# EAGLE design CAN Tester rev1 (EAGLE 9.2.1)
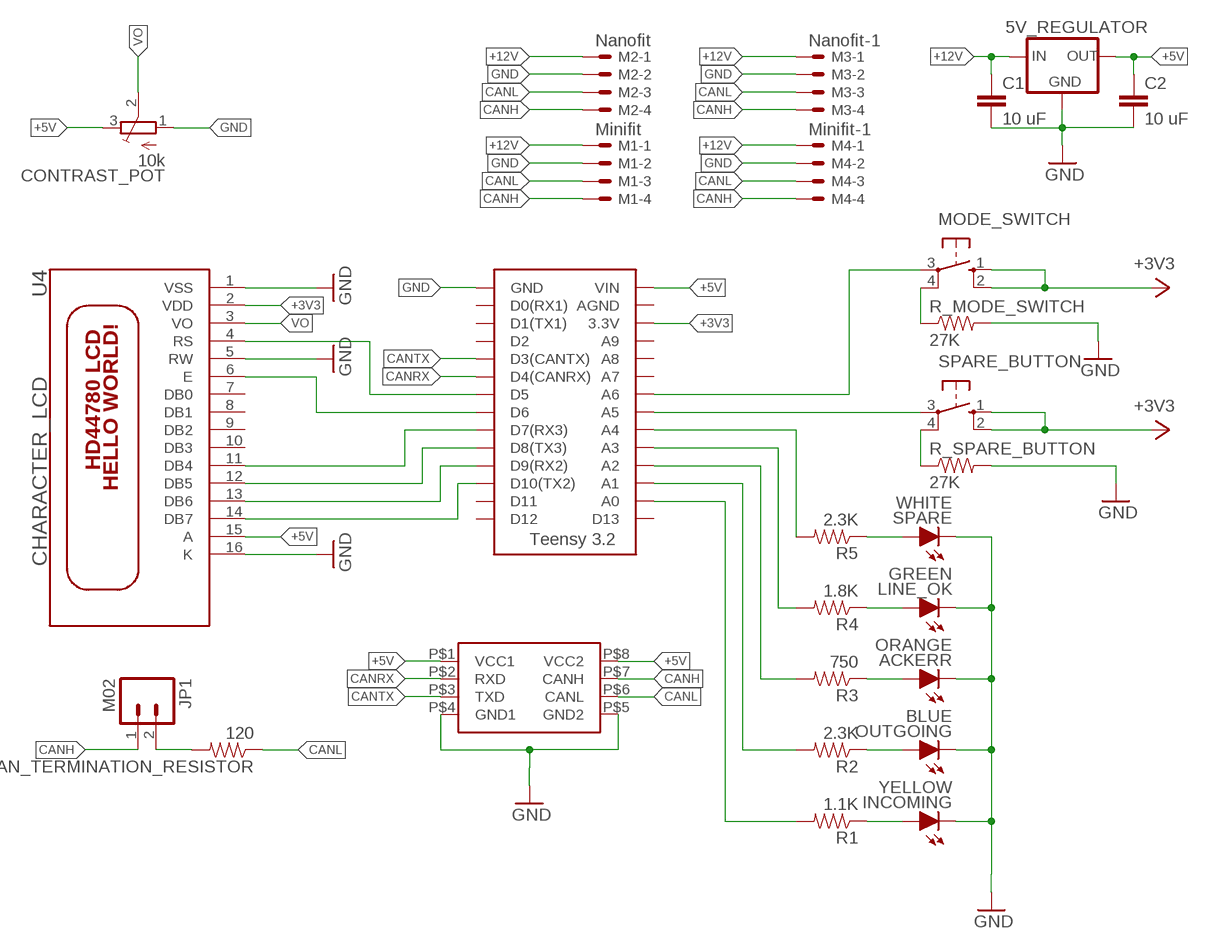
[diagram p0: schematic, sheet 1]

## Parts
5V_REGULATOR  5VREG_LM340-NLM340MPX-5.0/NOPB  [SOT223]
ACKERR  ORANGE  LED-0805  [LED-805]
C1  10 uF  CAP0805  [0805]
C2  10 uF  CAP0805  [0805]
CAN_TERMINATION_RESISTOR  120  RESISTOR0805-RES  [0805]
CONTRAST_POT  10k  TRIMPOT3386  [TRIM-3386]
INCOMING  YELLOW  LED-0805  [LED-805]
JP1  M02  [1X02]
LINE_OK  GREEN  LED-0805  [LED-805]
M1  Minifit  CONNECTOR-4  [MINIFIT_5566-4]
M2  Nanofit  CONNECTOR-4NANO-FIT-VERTICAL-4  [NANO-FIT_VERTICAL-4]
M3  Nanofit-1  CONNECTOR-4NANO-FIT-VERTICAL-4  [NANO-FIT_VERTICAL-4]
M4  Minifit-1  CONNECTOR-4  [MINIFIT_5566-4]
MODE_SWITCH  BTN_10-XX  [B3F-10XX]
OUTGOING  BLUE  LED-0805  [LED-805]
R1  1.1K  RESISTOR0805-RES  [0805]
R2  2.3K  RESISTOR0805-RES  [0805]
R3  750  RESISTOR0805-RES  [0805]
R4  1.8K  RESISTOR0805-RES  [0805]
R5  2.3K  RESISTOR0805-RES  [0805]
R_MODE_SWITCH  27K  RESISTOR0805-RES  [0805]
R_SPARE_BUTTON  27K  RESISTOR0805-RES  [0805]
SPARE  WHITE  LED-0805  [LED-805]
SPARE_BUTTON  BTN_10-XX  [B3F-10XX]
U1  ISOLATED CAN TRANSCIEVER  ISO1050CAN  [DUB8]
U3  TEENSY_3.2_SIMPLE  [TEENSY_3.2_SIMPLE]
U4  CHARACTER_LCD  HD44780LCD-1602  [LCD1602]

## Nets
+3V3: MODE_SWITCH.1(S) MODE_SWITCH.2(S1) SPARE_BUTTON.1(S) SPARE_BUTTON.2(S1) U3.3.3V U4.2(VDD)
+5V: 5V_REGULATOR.3(OUT) C2.1 CONTRAST_POT.3(E) U1.P$1(VCC1) U1.P$8(VCC2) U3.VIN U4.15(A)
+12V: 5V_REGULATOR.1(IN) C1.1 M1.1 M2.P$1 M3.P$1 M4.1
CANH: JP1.1 M1.4 M2.P$4 M3.P$4 M4.4 U1.P$7(CANH)
CANL: CAN_TERMINATION_RESISTOR.1 CAN_TERMINATION_RESISTOR.2 JP1.2 M1.3 M2.P$3 M3.P$3 M4.3 U1.P$6(CANL)
CANRX: U1.P$2(RXD) U3.D4(CANRX)
CANTX: U1.P$3(TXD) U3.D3(CANTX)
GND: 5V_REGULATOR.2(GND) 5V_REGULATOR.4(GND) ACKERR.C C1.2 C2.2 CONTRAST_POT.1(A) INCOMING.C LINE_OK.C M1.2 M2.P$2 M3.P$2 M4.2 OUTGOING.C R_MODE_SWITCH.2 R_SPARE_BUTTON.2 SPARE.C U3.GND U4.1(VSS) U4.5(RW) U4.16(K)
N$1: R1.2 U3.A0
N$2: R5.1 SPARE.A
N$3: SPARE_BUTTON.3(P) U3.A5
N$4: R2.2 U3.A1
N$5: R3.2 U3.A2
N$6: R4.2 U3.A3
N$7: R5.2 U3.A4
N$8: LINE_OK.A R4.1
N$9: ACKERR.A R3.1
N$10: OUTGOING.A R2.1
N$11: INCOMING.A R1.1
N$12: MODE_SWITCH.4(P1) R_MODE_SWITCH.1
N$13: MODE_SWITCH.3(P) U3.A6
N$14: R_SPARE_BUTTON.1 SPARE_BUTTON.4(P1)
N$16: U1.P$4(GND1) U1.P$5(GND2)
N$17: U3.D5 U4.4(RS)
N$18: U3.D6 U4.6(E)
N$19: U3.D7(RX3) U4.11(DB4)
N$20: U3.D8(TX3) U4.12(DB5)
N$21: U3.D9(RX2) U4.13(DB6)
N$22: U3.D10(TX2) U4.14(DB7)
VO: CONTRAST_POT.2(S) U4.3(VO)
Unconnected: U3.A7 U3.A8 U3.A9 U3.AGND U3.D0(RX1) U3.D1(TX1) U3.D2 U3.D11 U3.D12 U3.D13 U4.7(DB0) U4.8(DB1) U4.9(DB2) U4.10(DB3)

## Library data of the parts
5V_REGULATOR = HyTechDevices:5VREG_LM340-N: Voltage Regulator 5v linear voltage regulator Datasheet <http://www.mouser.com/ProductDetail/Texas-Instruments/LM340MPX-50-NOPB/?qs=X1J7HmVL2ZGZwtTFRQ9ItA%3D%3D> MAX current out: 1.5A MAX voltage in: 35V
ACKERR INCOMING LINE_OK OUTGOING SPARE = HyTechDevices:LED: Light Emitting Diode (LED) Source: Dangerous Prototypes Eagle Library <https://github.com/DangerousPrototypes/Eagle_Part_Library>
C1 C2 = HyTechDevices:CAP: Capacitor Standard 0603 ceramic capacitor, and 0.1" leaded capacitor.
CAN_TERMINATION_RESISTOR R1-R5 R_MODE_SWITCH R_SPARE_BUTTON = HyTechDevices:RESISTOR: Resistor Basic schematic elements and footprints for 0603, 1206, and PTH resistors.
CONTRAST_POT = HyTechDevices:TRIMPOT: SMT trimmer potentiometer part number TC33X http://www.ladyada.net/library/eagle
JP1 = HyTechDevices:M02: Standard 2-pin 0.1" header. NOTES ON THE VARIANTS LOCK and LOCK_LONGPADS... This footprint was designed to help hold the alignment of a through-hole component (i.e. 6-pin header) while soldering it into place. You may notice that each hole has been shifted either up or down by 0.005 of an inch from it's more standard position (which is a perfectly straight line). This slight alteration caused the pins (the squares in the middle) to touch the edges of the holes. Because they are alternating, it causes a "brace" to hold the component in place. 0.005 has proven to be the perfect amount of "off-center" position when using our standard breakaway headers. Although looks a little odd when you look at the bare footprint, once you have a header in there, the alteration is very hard to notice. Also,if you push a header all the way into place, it is covered up entirely on the bottom side. This idea of altering the position of holes to aid alignment will be further integrated into the Sparkfun Library for other footprints. It can help hold any component with 3 or more connection pins. Note: The Sparkfun version includes many other packages including surface mount that may be of future interest. Source: Sparkfun <https://github.com/sparkfun/SparkFun-Eagle-Libraries>
M1 M4 = HyTechDevices:CONNECTOR-4: Mini-Fit Junior connector 4 pole Source: http://www.molex.com; OC_FARNELL: unknown; OC_NEWARK: unknown
M2 M3 = HyTechDevices:CONNECTOR-4: Mini-Fit Junior connector 4 pole Source: http://www.molex.com
MODE_SWITCH SPARE_BUTTON = HyTechDevices:BTN_10-XX: Small momentary tactile push button; MPN: B3F-1000; OC_FARNELL: 176432; OC_NEWARK: 36M3542
U1 = HyTechDevices:ISO1050CAN
U3 = HyTechDevices:TEENSY_3.2_SIMPLE: Simple version of the Teensy 3.2 board that only uses the 2 main rows of pins, not the inner pins or the pins opposite the usb port.
U4 = HyTechDevices:HD44780LCD: HD44780 LCD Standard character type LCDs, available in sizes from 8x1 to 40x4!

## Net classes
0 default: width 0.406 mm, clearance 0.406 mm

## Board
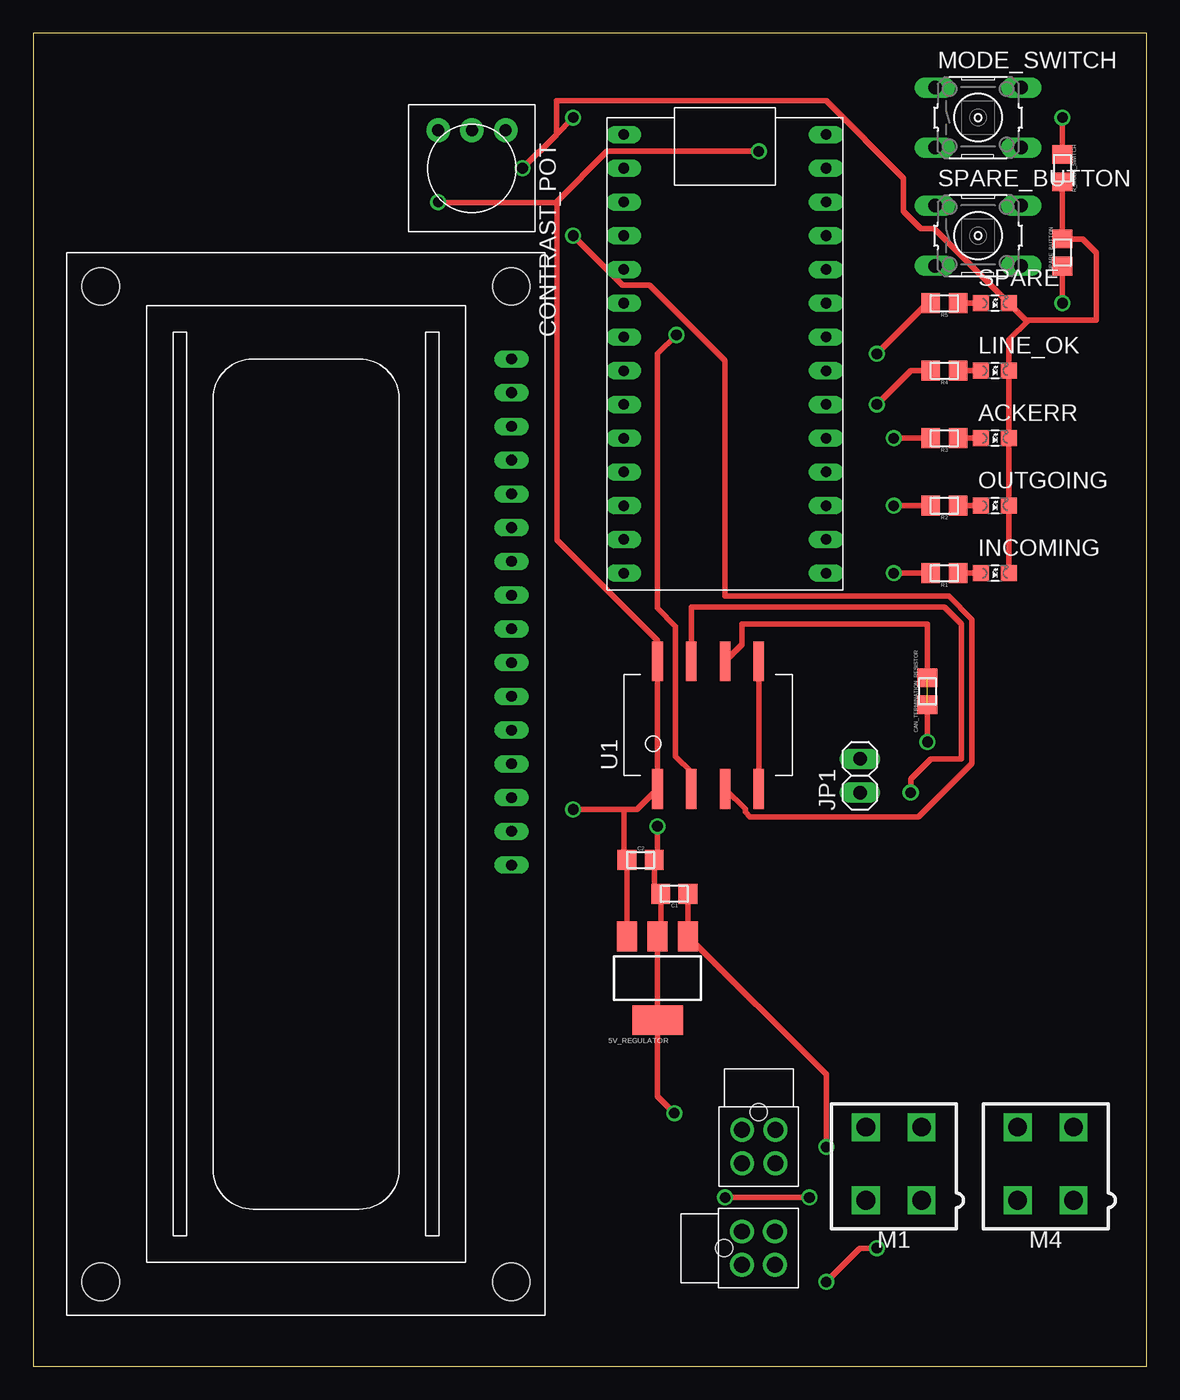
[diagram p1: board, top side]
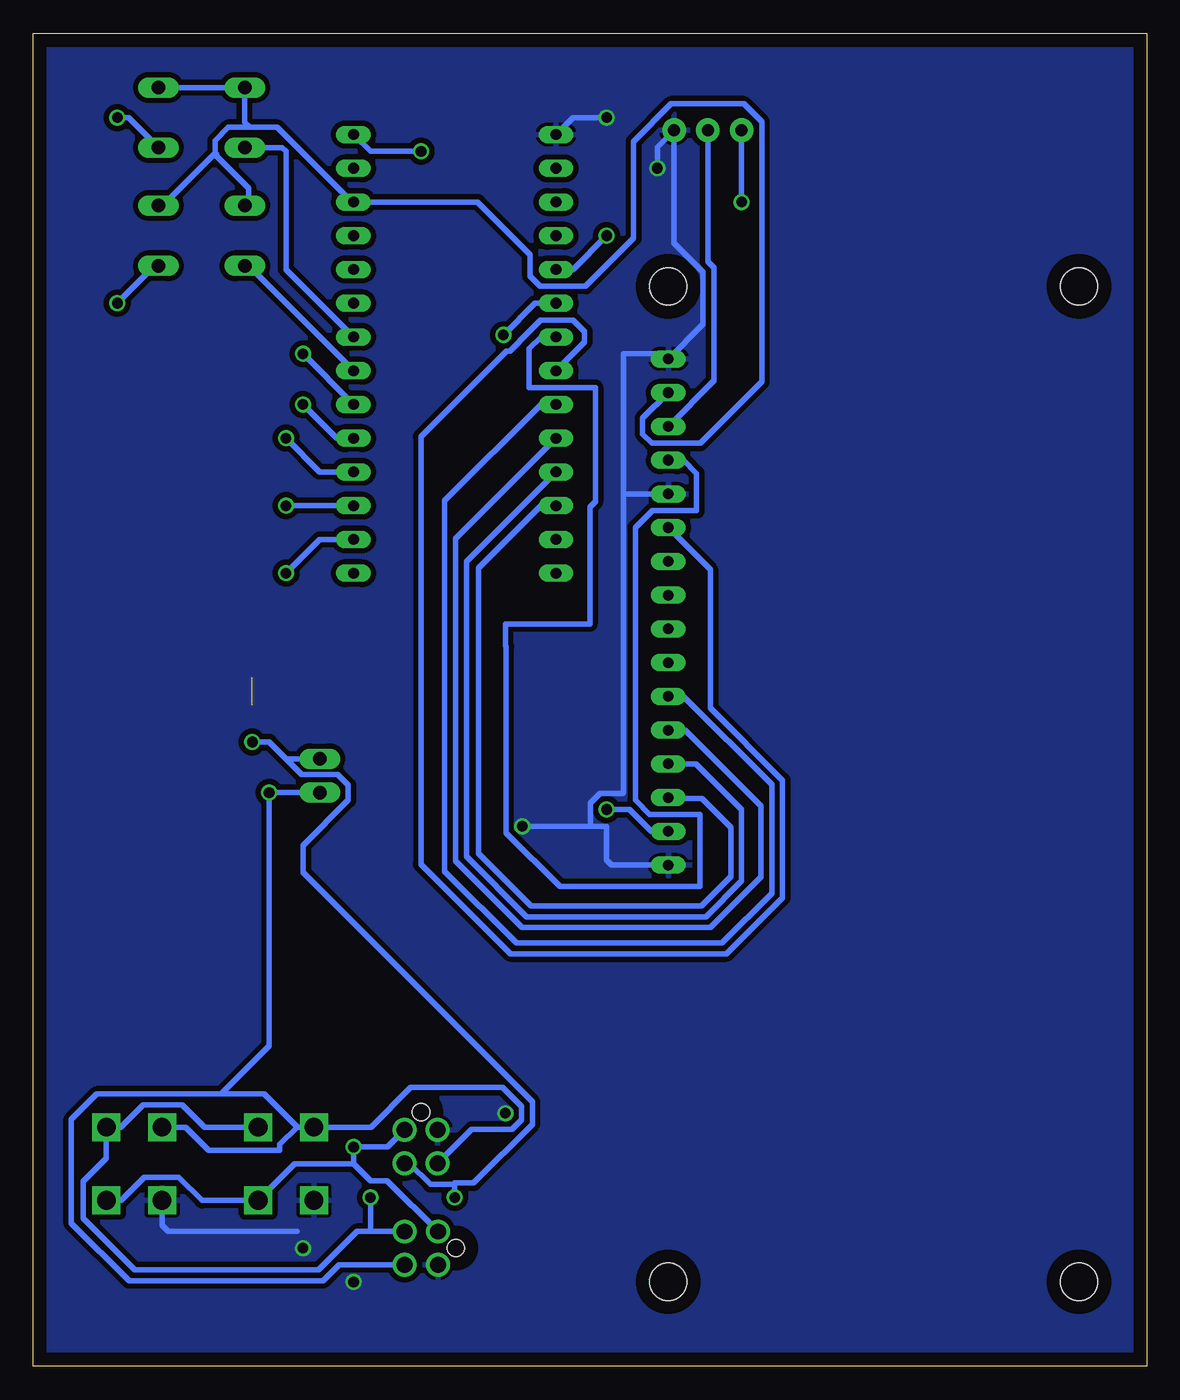
[diagram p2: board, bottom side, seen from below]

Size 83.8 x 100.33 mm. Coordinates in mm from the lower left corner, seen from the top.
Outline: 0,0 83.8,0 83.8,100.33 0,100.33 0,0
Copper layers (1*16): Top 0.035mm / dielectric 1.5mm / Bottom 0.035mm
Design rules "DRC Electronics Lab *": minimum track width 16mil, minimum drill 19mil, track to track 16mil, track to pad 12mil, pad to pad 16mil, via to via 16mil, smd to smd 10mil, copper to edge 40mil, drill to drill 10mil, minimum pad ring 10mil, minimum via ring 8mil, stop-mask expansion 4mil, vias tented up to drill 0mil, thermal gap 10mil

### Footprints (pad centres in the part's own frame; a part is rotated, then mirrored left to right if it is on the bottom)
SOT223 = smd 1.5 x 2.235: 1 -2.3,-3.15; 2 0,-3.15; 3 2.3,-3.15 | smd 3.8 x 2.2: 4 0,3.15
LED-805 = smd 1.2 x 1.2: A 0,-1.05; C 0,1.05
0805 = smd 1.4 x 1.5: 1 -1.025,0; 2 1.025,0
TRIM-3386 = drill 0.9 pad 1.778: 1 -2.54,-2.857; 2 0,-2.857; 3 2.54,-2.857
1X02 = drill 1.016 long: 1 -1.27,0; 2 1.27,0
MINIFIT_5566-4 = drill 1.4 square: 1 2.1,-2.75; 2 -2.1,-2.75; 3 2.1,2.75; 4 -2.1,2.75
NANO-FIT_VERTICAL-4 = drill 1.2: P$1 -1.25,0; P$2 1.25,0; P$3 -1.25,2.5; P$4 1.25,2.5 | hole 1.3: 0,-1.34
B3F-10XX = drill 1.016 long: 1 -3.251,2.261; 2 3.251,2.261; 3 -3.251,-2.261; 4 3.251,-2.261
DUB8 = smd 0.8 x 3: P$1 -3.81,-4.8; P$2 -1.27,-4.8; P$3 1.27,-4.8; P$4 3.81,-4.8; P$5 3.81,4.8; P$6 1.27,4.8; P$7 -1.27,4.8; P$8 -3.81,4.8
TEENSY_3.2_SIMPLE = drill 0.8 long: 3.3V 16.51,29.21; A0 16.51,3.81; A1 16.51,6.35; A2 16.51,8.89; A3 16.51,11.43; A4 16.51,13.97; A5 16.51,16.51; A6 16.51,19.05; A7 16.51,21.59; A8 16.51,24.13; A9 16.51,26.67; AGND 16.51,31.75; D0(RX1) 1.27,31.75; D1(TX1) 1.27,29.21; D2 1.27,26.67; D3(CANTX) 1.27,24.13; D4(CANRX) 1.27,21.59; D5 1.27,19.05; D6 1.27,16.51; D7(RX3) 1.27,13.97; D8(TX3) 1.27,11.43; D9(RX2) 1.27,8.89; D10(TX2) 1.27,6.35; D11 1.27,3.81; D12 1.27,1.27; D13 16.51,1.27; GND 1.27,34.29; VIN 16.51,34.29
LCD1602 = drill 0.8 long: 1 8,33.46; 2 10.54,33.46; 3 13.08,33.46; 4 15.62,33.46; 5 18.16,33.46; 6 20.7,33.46; 7 23.24,33.46; 8 25.78,33.46; 9 28.32,33.46; 10 30.86,33.46; 11 33.4,33.46; 12 35.94,33.46; 13 38.48,33.46; 14 41.02,33.46; 15 43.56,33.46; 16 46.1,33.46 | hole 2.8: 2.54,2.54; 2.54,33.46; 77.46,33.46; 77.46,2.54

### Placement (x,y rotation side)
5V_REGULATOR  46.99,29.21 180 top
ACKERR  72.39,69.85 270 top
C1  48.26,35.56 180 top
C2  45.72,38.1 0 top
CAN_TERMINATION_RESISTOR  67.31,50.8 90 top
CONTRAST_POT  33.02,90.17 180 top
INCOMING  72.39,59.69 270 top
JP1  62.23,44.45 90 top
LINE_OK  72.39,74.93 270 top
M1  64.77,15.24 0 top
M2  53.34,8.89 270 top
M3  54.61,17.78 180 top
M4  76.2,15.24 0 top
MODE_SWITCH  71.12,93.98 0 top
OUTGOING  72.39,64.77 270 top
R1  68.58,59.69 180 top
R2  68.58,64.77 180 top
R3  68.58,69.85 180 top
R4  68.58,74.93 180 top
R5  68.58,80.01 180 top
R_MODE_SWITCH  77.47,90.17 270 top
R_SPARE_BUTTON  77.47,83.82 90 top
SPARE  72.39,80.01 270 top
SPARE_BUTTON  71.12,85.09 0 top
U1  50.8,48.26 0 top
U3  43.18,58.42 0 top
U4  2.54,83.82 270 top

### Tracks (layer width: path | path; a pad name or v marks a point on that pad's centre or on a via)
+3V3
  Bottom 0.406: SPARE_BUTTON.1 67.59,87.63 67.59,88.67 69.47,90.55 70,91.09 70,91.21 70.1,91.31 | 70.1,91.31 70.1,92.25 69.11,93.24 67.49,93.24 | 67.49,93.24 65.42,93.24 59.81,87.63 U3.3.3V 50.35,87.63 46.39,83.67 46.39,82.04 45.64,81.29 42.22,81.29 38.62,84.89 38.62,92.18 35.79,95.01 30.31,95.01 28.97,93.66 28.97,74.1 33.59,69.48 37.23,69.48 37.93,70.18 37.93,71.35 U4.2 | 67.49,93.24 67.87,93.62 MODE_SWITCH.1 MODE_SWITCH.2 | 70.1,91.31 74.07,87.35 SPARE_BUTTON.2
+5V  (via drill 0.8 pad 0.8)
  Top 0.406: 44.45,41.91 45.44,41.91 U1.P$1 U1.P$8 46.99,54.64 39.43,62.2 39.43,87.57 | 44.45,41.91 44.45,38.35 C2.1 5V_REGULATOR.3 | 44.45,41.91 v40.64,41.91 | 39.43,87.57 39.37,87.63 43.18,91.44 v54.61,91.44 | 39.43,87.57 30.54,87.57 v30.48,87.63
  Bottom 0.406: v40.64,41.91 38.92,41.91 37.27,40.26 U4.15 | v54.61,91.44 58.42,91.44 U3.VIN | v30.48,87.63 CONTRAST_POT.3
+12V  (via drill 0.8 pad 0.8)
  Top 0.406: C1.1 5V_REGULATOR.1 59.69,21.96 v59.69,16.51
  Bottom 0.406: M4.1 77.19,12.49 75.44,14.24 72.85,14.24 71.1,12.49 M1.1 64.12,15.24 59.69,15.24 | 59.69,15.24 v59.69,16.51 57.13,16.51 M3.P$1 | M2.P$1 57.17,13.97 58.42,13.97 59.69,15.24
CANH  (via drill 0.8 pad 0.8)
  Top 0.406: U1.P$7 49.53,57.15 68.58,57.15 69.85,55.88 69.85,45.72 67.56,45.72 66.04,44.21 v66.04,43.18
  Bottom 0.406: M4.4 72.32,17.99 70.59,16.25 65.24,16.25 65.24,16.7 63.94,17.99 | 63.94,17.99 M1.4 58.38,17.99 55.38,20.99 48.48,20.99 47.05,19.55 47.05,18.55 47.76,17.84 50.8,17.84 M3.P$4 | M2.P$4 60.79,7.64 62,6.43 76.59,6.43 80.92,10.77 80.92,18.58 79.01,20.5 69.67,20.5 | JP1.1 v66.04,43.18 66.04,24.13 69.67,20.5 | 69.67,20.5 66.42,20.5 65.21,19.29 63.94,18.03 63.94,17.99
CANL  (via drill 0.8 pad 0.8)  (1 unrouted)
  Top 0.406: U1.P$6 53.34,54.33 53.34,55.88 67.31,55.88 CAN_TERMINATION_RESISTOR.2 | v52.07,12.7 v58.42,12.7 | CAN_TERMINATION_RESISTOR.1 v67.31,46.99
  Bottom 0.406: M1.3 70.89,17.99 72.59,19.69 75.53,19.69 77.23,17.99 M4.3 78.3,15.66 80.05,13.91 80.05,11.13 76.16,7.25 62.33,7.25 59.44,10.14 58.42,10.14 | M2.P$3 58.42,10.14 | 52.07,13.68 53.9,13.68 55.5,15.28 M3.P$3 | 52.07,13.68 52.07,13.8 50.65,13.8 46.23,18.21 46.23,19.89 63.5,37.16 63.5,39.21 60.1,42.61 60.1,43.75 60.9,44.55 63.6,44.55 64.77,45.72 | v58.42,12.7 58.42,10.14 | 52.07,13.68 v52.07,12.7 | 64.77,45.72 JP1.2 | v67.31,46.99 66.04,46.99 64.77,45.72
CANRX  (via drill 0.8 pad 0.8)
  Top 0.406: v48.41,77.62 46.99,76.2 46.99,57.06 48.35,55.69 48.35,45.91 49.53,44.73 U1.P$2
  Bottom 0.406: U3.D4(CANRX) 46.03,80.01 v48.41,77.62
CANTX  (via drill 0.8 pad 0.8)
  Top 0.406: v40.64,85.09 44.35,81.38 46.38,81.38 52.07,75.69 52.07,57.96 68.92,57.96 70.66,56.22 70.66,45.38 66.63,41.35 53.96,41.35 53.6,41.71 53.6,41.93 U1.P$3
  Bottom 0.406: v40.64,85.09 43.18,82.55 U3.D3(CANTX)
GND  (via drill 0.8, 0.8 pad 0.8)
  Top 0.406: R_MODE_SWITCH.2 R_SPARE_BUTTON.2 78.98,84.84 80.01,83.82 80.01,78.74 74.93,78.74 | 74.93,78.74 74.71,78.74 SPARE.C 67.83,85.62 66.8,85.62 65.51,86.92 65.51,89.43 59.69,95.25 39.37,95.25 39.37,92.71 | 74.93,78.74 73.44,77.25 LINE_OK.C ACKERR.C OUTGOING.C INCOMING.C | v46.99,40.64 46.99,38.35 C2.2 46.74,36.05 C1.2 47.23,32.61 5V_REGULATOR.2 5V_REGULATOR.4 46.99,25.4 46.99,20.32 v48.26,19.05 | v36.83,90.17 39.37,92.71 | 39.37,92.71 v40.64,93.98 | v59.69,6.35 62.23,8.89 v63.5,8.89
  Bottom 0.406: U4.16 40.26,37.72 40.64,38.1 40.64,40.64 41.91,40.64 | 41.91,40.64 v46.99,40.64 | 39.37,65.66 U4.5 | 39.37,65.66 39.37,43.18 39.43,43.12 41.14,43.12 41.85,42.41 41.85,40.7 41.91,40.64 | 39.37,65.66 39.37,76.2 36.38,76.2 U4.1 33.38,78.44 33.38,82.36 35.56,84.54 CONTRAST_POT.1 36.83,91.76 v36.83,90.17 | v40.64,93.98 43.18,93.98 U3.GND | 63.94,10.16 68.58,10.16 | 68.58,10.16 73.66,10.16 74.1,10.6 M4.2 | 68.58,10.16
  pour Bottom: -5.08,102.87 -3.81,-2.54 85.09,-2.54 86.36,102.87
N$1  (via drill 0.8 pad 0.8)
  Top 0.406: v64.77,59.69 R1.2
  Bottom 0.406: U3.A0 62.23,62.23 v64.77,59.69
N$2
  Top 0.406: SPARE.A R5.1
N$3
  Bottom 0.406: U3.A5 67.59,82.83 SPARE_BUTTON.3
N$4  (via drill 0.8 pad 0.8)
  Top 0.406: v64.77,64.77 R2.2
  Bottom 0.406: U3.A1 v64.77,64.77
N$5  (via drill 0.8 pad 0.8)
  Top 0.406: v64.77,69.85 R3.2
  Bottom 0.406: U3.A2 62.23,67.31 v64.77,69.85
N$6  (via drill 0.8 pad 0.8)
  Top 0.406: v63.5,72.39 66.04,74.93 R4.2
  Bottom 0.406: U3.A3 60.96,69.85 v63.5,72.39
N$7  (via drill 0.8)
  Top 0.406: v63.5,76.2 67.31,80.01 R5.2
  Bottom 0.406: U3.A4 v63.5,76.2
N$8
  Top 0.406: R4.1 LINE_OK.A
N$9
  Top 0.406: R3.1 ACKERR.A
N$10
  Top 0.406: R2.1 OUTGOING.A
N$11
  Top 0.406: R1.1 INCOMING.A
N$12  (via drill 0.8 pad 0.8)
  Top 0.406: v77.47,93.98 R_MODE_SWITCH.1
  Bottom 0.406: MODE_SWITCH.4 76.63,93.98 v77.47,93.98
N$13
  Bottom 0.406: U3.A6 64.77,82.55 64.77,91.44 65.05,91.72 MODE_SWITCH.3
N$14  (via drill 0.8 pad 0.8)
  Top 0.406: R_SPARE_BUTTON.1 v77.47,80.01
  Bottom 0.406: v77.47,80.01 74.65,82.83 SPARE_BUTTON.4
N$16
  Top 0.406: U1.P$5 U1.P$4
N$17
  Bottom 0.406: 36.83,41.54 33.6,41.54 33.6,36.1 44.17,36.1 48.2,40.14 48.2,54.17 48.26,54.23 48.26,55.88 41.91,55.88 41.91,64.65 41.49,65.07 41.49,73.67 46.47,73.67 46.47,76.59 45.59,77.47 U3.D5 | 36.83,41.54 | 36.83,41.54 37.4,41.54 38.48,42.62 38.48,63.11 37.19,64.4 33.87,64.4 33.87,67.2 34.87,68.2 U4.4
N$18
  Bottom 0.406: 45.59,78.73 43.16,78.73 42.3,77.88 42.3,77.86 42.3,77.47 42.3,77.08 U3.D6 | U4.6 32.84,59.96 32.84,49.54 27.4,44.11 27.4,35.26 31.62,31.05 47.88,31.05 54.61,37.78 54.61,69.97 48.17,76.41 47.91,76.41 47.2,77.12 47.2,77.16 45.63,78.73 45.59,78.73 | 45.59,78.73
N$19
  Bottom 0.406: U4.11 34.87,50.42 28.21,43.77 28.21,35.6 31.96,31.86 47.42,31.86 52.83,37.26 52.83,65.15 45.59,72.39 U3.D7(RX3)
N$20
  Bottom 0.406: U3.D8(TX3) 52.01,62.29 52.01,38.04 46.99,33.02 32.84,33.02 29.03,36.83 29.03,42.18 34.73,47.88 U4.12
N$21
  Bottom 0.406: U3.D9(RX2) 51.2,60.56 51.2,38.38 46.65,33.83 33.17,33.83 30.48,36.53 30.48,41.91 33.91,45.34 U4.13
N$22
  Bottom 0.406: U3.D10(TX2) 45.59,64.77 50.29,60.07 50.29,38.62 46.32,34.65 33.51,34.65 31.29,36.86 31.29,40.56 33.47,42.73 35.93,42.73 U4.14
VO
  Bottom 0.406: CONTRAST_POT.2 33.02,83.15 32.57,82.7 32.57,74.17 U4.3